# EAGLE design 202_9axisRev010100 (EAGLE 9.6.2)
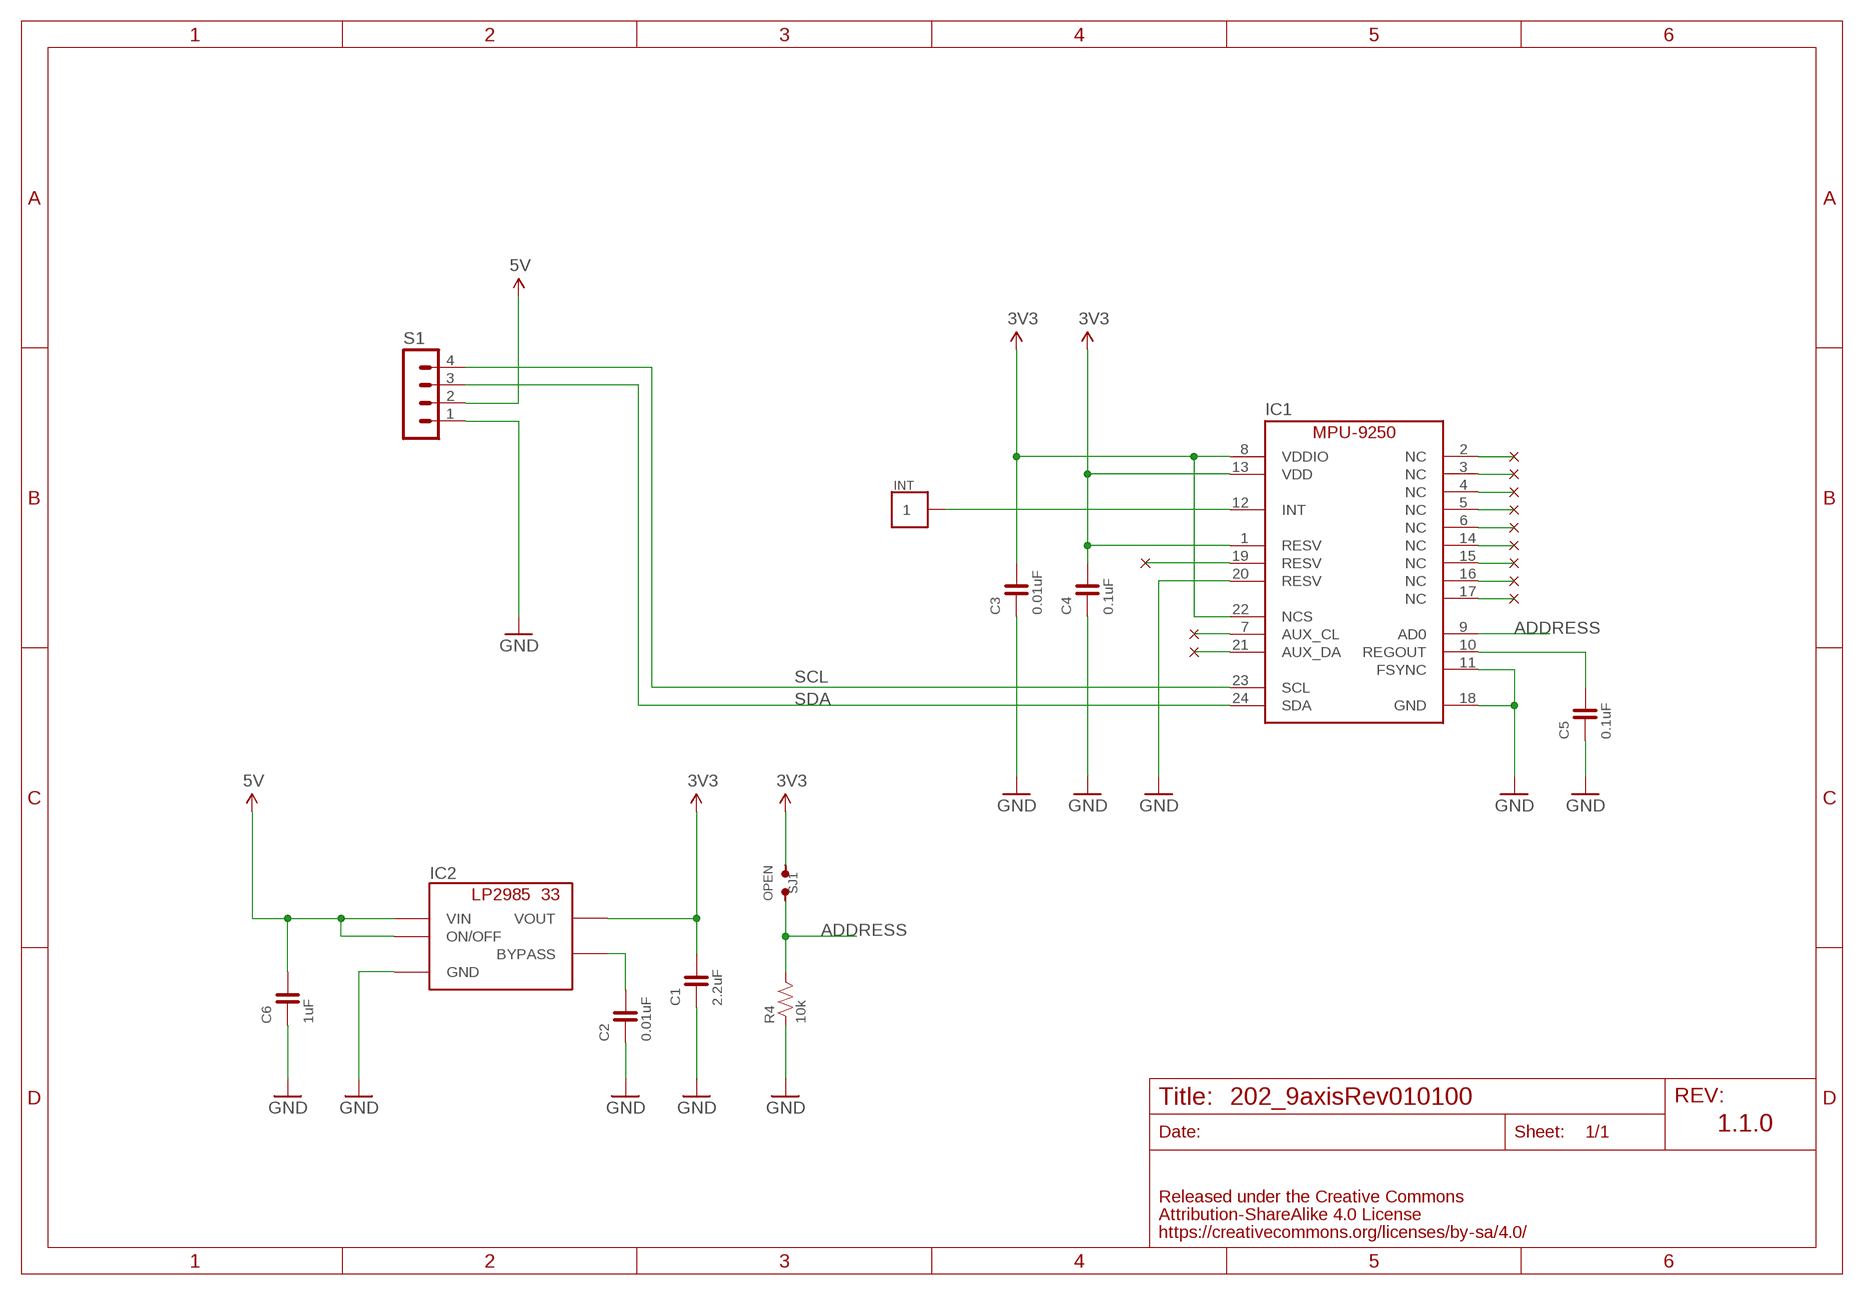
[diagram p0: schematic, sheet 1]

## Parts
C1  2.2uF  CAPACITOR-0603  [0603]
C2  0.01uF  CAPACITOR-0603  [0603]
C3  0.01uF  CAPACITOR-0603  [0603]
C4  0.1uF  CAPACITOR-0603  [0603]
C5  0.1uF  CAPACITOR-0603  [0603]
C6  1uF  CAPACITOR-0603  [0603]
IC1  IS-MPU9250  [INVENSENSE-MPU9250]
IC2  LP2985-33DBV  [SOT-23-5]
INT  PIN_1X1  [PIN_1X1]
R4  10k  RESISTOR-0603  [0603]
S1  MA04-1  [MA04-1]
SJ1  OPEN  SMD-JUMPER-2-OPEN  [SMD-JUMPER-2-OPEN]

## Nets
3V3: C1.2 C3.2 C4.2 IC1.1(RESV) IC1.8(VDDIO) IC1.13(VDD) IC1.22(NCS) IC2.5(VOUT) SJ1.1
5V: C6.2 IC2.1(VIN) IC2.3(ON/OFF) S1.2
ADDRESS: IC1.9(AD0) R4.2 SJ1.2
GND: C1.1 C2.1 C3.1 C4.1 C5.1 C6.1 IC1.11(FSYNC) IC1.18(GND) IC1.20(RESV) IC2.2(GND) R4.1 S1.1
N$1: C2.2 IC2.4(BYPASS)
N$2: IC1.12(INT) INT.1
N$3: IC1.2(NC)
N$4: IC1.3(NC)
N$5: IC1.4(NC)
N$6: IC1.5(NC)
N$7: IC1.6(NC)
N$8: IC1.14(NC)
N$9: IC1.15(NC)
N$10: IC1.16(NC)
N$11: IC1.17(NC)
N$12: IC1.7(AUX_CL)
N$13: IC1.21(AUX_DA)
N$14: IC1.19(RESV)
REGOUT: C5.2 IC1.10(REGOUT)
SCL: IC1.23(SCL) S1.4
SDA: IC1.24(SDA) S1.3

## Notes on the sheet
- 33
- 1.1.0

## Library data of the parts
C1-C6 = FaBo-Capacitor:CAPACITOR: CAPACITOR
IC1 = FaBo-Mems:IS-MPU9250: INVENSENSE MPU9250(9axis)
IC2 = FaBo-Supply:LP2985: LP2985
INT = FaBo-PIN:PIN_1X1
R4 = FaBo-Resistors:RESISTOR: RESISTOR
S1 = con-lstb:MA04-1: PIN HEADER; OC_FARNELL: unknown; OC_NEWARK: unknown
SJ1 = FaBo-Supply:SMD-JUMPER-2

## Board
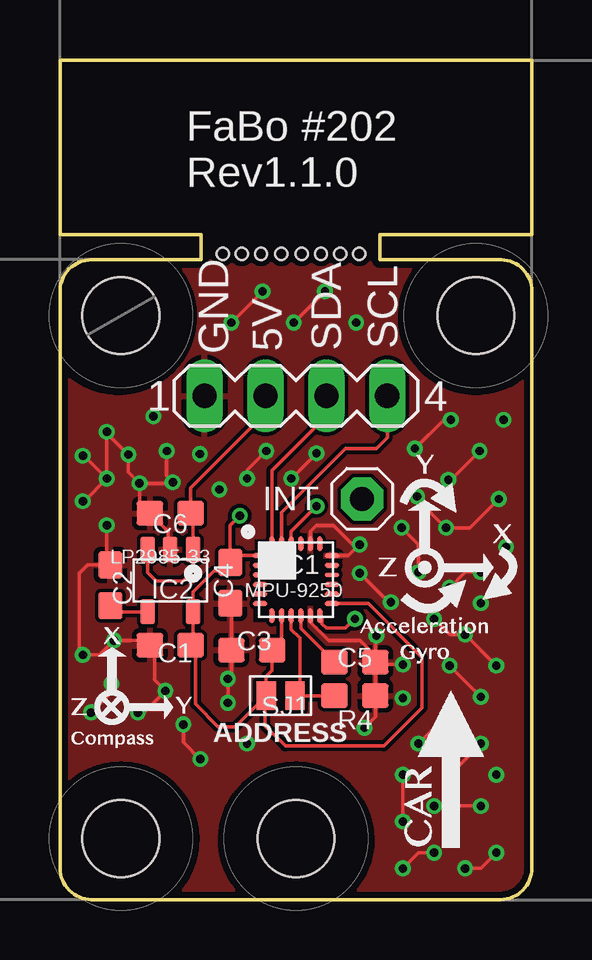
[diagram p1: board, top side]
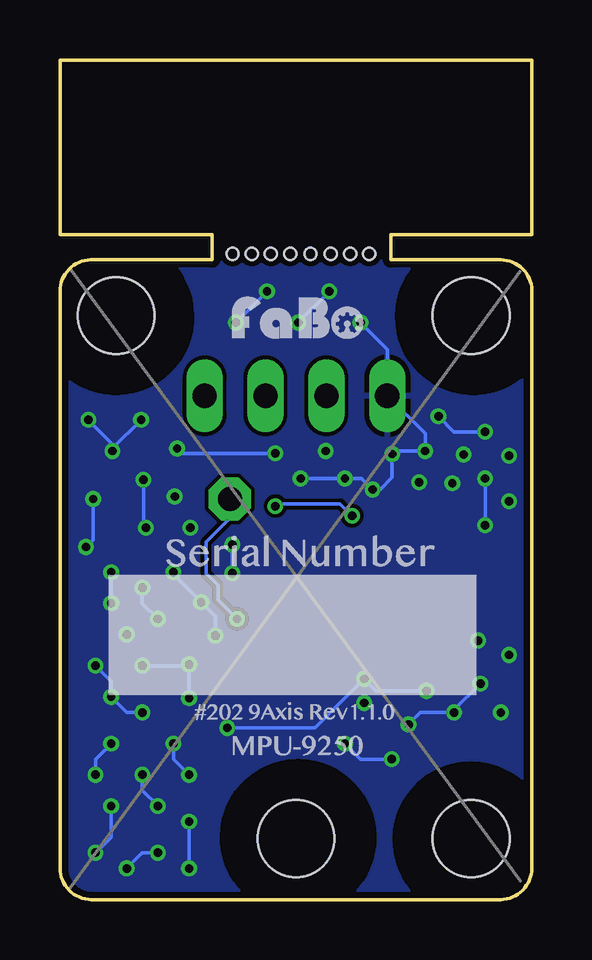
[diagram p2: board, bottom side, seen from below]

Size 19.68 x 35 mm. Coordinates in mm from the lower left corner, seen from the top.
Outline: 0,1.3 0,25.4 arc-88 1.3,26.67 5.88,26.67 5.88,27.72 0,27.72 0,35 19.68,35 19.68,27.72 13.34,27.72 13.34,26.67 18.41,26.67 arc-88 19.68,25.37 19.68,1.3 arc-88 18.39,0 1.3,0 arc-88 0,1.3
Copper layers (1*16): Top 0.035mm / dielectric 1.6mm / Bottom 0.035mm
Design rules "PCBway": minimum track width 6mil, minimum drill 12mil, track to track 6mil, track to pad 6mil, pad to pad 6mil, via to via 6mil, smd to smd 6mil, copper to edge 10mil, drill to drill 10mil, minimum pad ring 10mil, minimum via ring 6mil, stop-mask expansion 2mil, vias tented up to drill 100mil, thermal gap 8mil
Holes 3.2 mm at 2.54,2.54 17.34,24.34 2.54,24.34 9.84,2.54
Holes 0.5 mm at 6.79,26.91 7.59,26.91 10.09,26.91 8.39,26.91 9.24,26.91 10.89,26.91 11.69,26.91 12.49,26.91
tRestrict: 4 lines
bRestrict: 4 lines

### Footprints (pad centres in the part's own frame; a part is rotated, then mirrored left to right if it is on the bottom)
0603 = smd 1.1 x 1: 1 -0.85,0; 2 0.85,0
INVENSENSE-MPU9250 = smd 0.6 x 0.2: 1 -1.5,1; 2 -1.5,0.6; 3 -1.5,0.2; 4 -1.5,-0.2; 5 -1.5,-0.6; 6 -1.5,-1; 13 1.5,-1; 14 1.5,-0.6; 15 1.5,-0.2; 16 1.5,0.2; 17 1.5,0.6; 18 1.5,1 | smd 0.2 x 0.6: 7 -1,-1.5; 8 -0.6,-1.5; 9 -0.2,-1.5; 10 0.2,-1.5; 11 0.6,-1.5; 12 1,-1.5; 19 1,1.5; 20 0.6,1.5; 21 0.2,1.5; 22 -0.2,1.5; 23 -0.6,1.5; 24 -1,1.5
SOT-23-5 = smd 0.6 x 1.05: 1 -0.95,-1.3; 2 0,-1.3; 3 0.95,-1.3; 4 0.95,1.3; 5 -0.95,1.3
PIN_1X1 = drill 1 pad 1.778 octagon: 1 0,0
MA04-1 = drill 1.016 long: 1 -3.81,0; 2 -1.27,0; 3 1.27,0; 4 3.81,0
SMD-JUMPER-2-OPEN = smd 0.8 x 1.2: 1 -0.6,0; 2 0.6,0

### Placement (x,y rotation side)
C1  4.6,10.6 0 top
C2  2.1,13.1 270 top
C3  8,10.4 0 top
C4  7.1,13.2 90 top
C5  12.3,9.9 180 top
C6  4.6,16.1 0 top
IC1  9.84,13.34 0 top
IC2  4.6,13.3 180 top
INT  12.6,16.7 0 top
R4  12.3,8.5 180 top
S1  9.84,21 0 top
SJ1  9.2,8.5 0 top
U$2  [LOGO_FABO_S_BOTTOM]  9.71,23.38 0 top

### Tracks (layer width: path | path; a pad name or v marks a point on that pad's centre or on a via)
3V3  (via drill 0.35)
  Top 0.152: IC1.8 9.24,10.79 C3.2 8.85,9.55 8.6,9.3 SJ1.1 8.55,8.45 | IC2.5 5.55,10.7 C1.2 | 8.55,8.45 7.3,7.2 6.6,7.2 5.65,8.15 5.65,10.3 5.55,10.4 IC2.5 | IC2.5 5.55,12.82 6.43,13.7 6.75,13.7 C4.2 | C4.2 7.38,14.34 IC1.1 | IC1.22 9.64,15.34 v10.7,16.4 | v7.5,16 7.1,15.6 C4.2 | IC1.13 12.87,12.34 15.1,10.1 15.1,8 13.5,6.4 9.4,6.4 8.55,7.25 8.55,8.45
  Bottom 0.152: v10.7,16.4 10.6,16.5 8,16.5 v7.5,16
5V
  Top 0.152: S1.2 8.57,20.27 5.45,17.15 C6.2 5.55,16 IC2.1 5.55,13.7 5.13,13.28 4.01,13.28 3.65,13.64 IC2.3
ADDRESS
  Top 0.152: IC1.9 9.64,11.26 10,10.9 10,8.7 SJ1.2 R4.2
GND  (via drill 0.35)
  Top 0.152: C5.1 R4.1 13.15,7.61 v12.7,7.16 | C4.1 7.15,12.3 C3.1 7.15,9.35 v7,9.2 v7,8.2 | IC1.11 10.44,11.56 11.2,10.8 12.5,10.8 13.15,10.15 C5.1 | IC1.20 10.44,15.34 10.7,15.6 11.4,15.6 12.2,14.8 v12.5,14.8 12.04,14.34 IC1.18 11.35,14.33 11.65,14.33 | C5.1 13.15,10.95 v13.2,11 | C5.1 13.25,9.8 v14.3,9.8 | v3.25,7.8 3.5,7.8 v4.4,8.7 3.95,9.15 3.95,10.4 C1.1 3.55,10.8 v2.25,10.8 1.65,10.2 v0.95,10.2 0.8,10.35 0.8,13.6 1.15,13.95 C2.1 1.95,14.1 v1.95,15.6 | v2.15,9 2.15,8.65 v1.3,7.8 | v5.15,7.3 5.15,6.55 v5.85,5.85 | v1.95,17.55 v1.95,19.5 1.95,19.45 v2.85,18.55 2.85,17.82 v3.32,17.35 | v16.25,9.75 v17.55,8.45 | v18.2,9.75 v16.9,11.05 16.25,11.05 v15.6,11.7 | v16.25,13 16.9,13.65 v17.55,13.65 | v14.95,13.65 14.95,14.8 v14.25,15.5 | v7.15,24.05 v8.45,25.35 | v9.75,24.05 v11.05,25.35 | v16.25,7.8 v14.95,6.5 | v14.3,5.2 v14.3,3.25 | v14.3,1.3 14.95,1.95 v15.6,1.95 | v16.9,1.3 17.55,1.3 v18.2,1.95 | v17.55,3.9 v15.6,3.9 | v16.25,5.2 v17.55,6.5 | v10.7,18.6 v9.65,17.55 | v14.8,18.8 16,20 v16.3,20 | v17.5,18.7 16.3,17.5 v16.2,17.5 | v18.3,16.7 17.1,15.5 v16.1,15.5 14.9,16.7 v14.9,16.8 | v0.95,18.5 1,18.5 v1.95,17.55 | v0.95,16.6 1,16.6 v1.95,17.55 | v13.8,12.4 13.7,12.4 v12.5,13.6 | v7.8,17.55 7.8,17.9 v8.6,18.7 | v3.32,17.35 3.32,16.53 C6.1 4.5,15.35 4.5,14.7 IC2.2 | v3.32,17.35 4.65,17.35 v4.7,17.4 4.45,17.65 v4.45,18.7
  Bottom 0.152: v13.2,11 13.2,11.8 v13.8,12.4 14.95,13.55 v14.95,13.65 | v4.4,8.7 6.5,8.7 v7,9.2 9.04,7.16 v12.7,7.16 | v14.3,8.4 v14.3,9.8 14.35,9.75 v16.25,9.75 | v9.65,17.55 v7.8,17.55 7.1,17.55 v6.65,17.09 6.33,17.09 5.83,17.59 5.83,18.53 | v2.15,9 3.25,7.9 v3.25,7.8 4.65,7.8 v5.15,7.3 | v5.85,5.85 7.15,5.85 v7.8,6.5 | v1.95,15.6 v1.95,17.55 | v1.95,19.5 3.25,19.5 v3.9,20.15 | v18.2,9.75 17.55,9.1 v17.55,8.45 16.9,7.8 v16.25,7.8 | v15.6,11.7 16.25,12.35 v16.25,13 | v17.55,13.65 v17.55,12.35 | v7.15,24.05 6.03,22.93 S1.1 4.45,19.42 v4.45,18.7 5.66,18.7 5.83,18.53 | v8.45,25.35 v9.75,24.05 | v11.05,25.35 v12.35,24.05 | v14.95,6.5 14.95,5.85 v14.3,5.2 | v14.3,3.25 v14.3,1.3 | v15.6,1.95 16.25,1.95 v16.9,1.3 | v18.2,1.95 17.55,2.6 v17.55,3.9 | v15.6,3.9 16.25,4.55 v16.25,5.2 | v17.55,6.5 18.2,5.85 v18.2,5.2 | v10.7,18.6 14.6,18.6 v14.8,18.8 | v16.3,20 17.5,18.8 v17.5,18.7 17.5,19 v18.5,20 | v16.2,17.5 16.2,15.6 v16.1,15.5 | v18.3,16.7 18.3,15 v18.6,14.7 | v12.5,14.8 v12.5,13.6 | 5.83,18.53 v5.83,18.57
  pour Bottom (rank 6): -1.26,36.39 21.11,36.39 21.11,-1.26 -1.26,-1.26
  pour Top (rank 6): -0.76,-0.97 -0.76,36.54 20.71,36.54 20.71,-0.97
N$1
  Top 0.152: IC2.4 2.35,12 C2.2
N$2  (via drill 0.35)
  Top 0.152: IC1.12 10.94,11.74 10.94,11.5 11.12,11.32 11.92,11.32 v12.3,11.7
  Bottom 0.152: INT.1 12.6,15.9 13.6,14.9 13.6,13.6 13.1,13.1 13.1,12.5 v12.3,11.7
REGOUT
  Top 0.152: IC1.10 10.04,11.31 C5.2
SCL
  Top 0.152: IC1.23 9.24,16.14 11.9,18.8 13.2,18.8 13.65,19.25 S1.4
SDA
  Top 0.152: IC1.24 8.84,17.89 11.11,20.16 S1.3

### Text on the board
tPlace: FaBo #202 / Rev1.1.0 | GND | 5V | SDA | SCL | ADDRESS
tDocu: 202 9AXIS Revision 1.1.0 / 2023/09/19
_tNames: LP2985-33 | MPU-9250